# EAGLE design SL869-GL868-Cx (EAGLE 7.1.0)
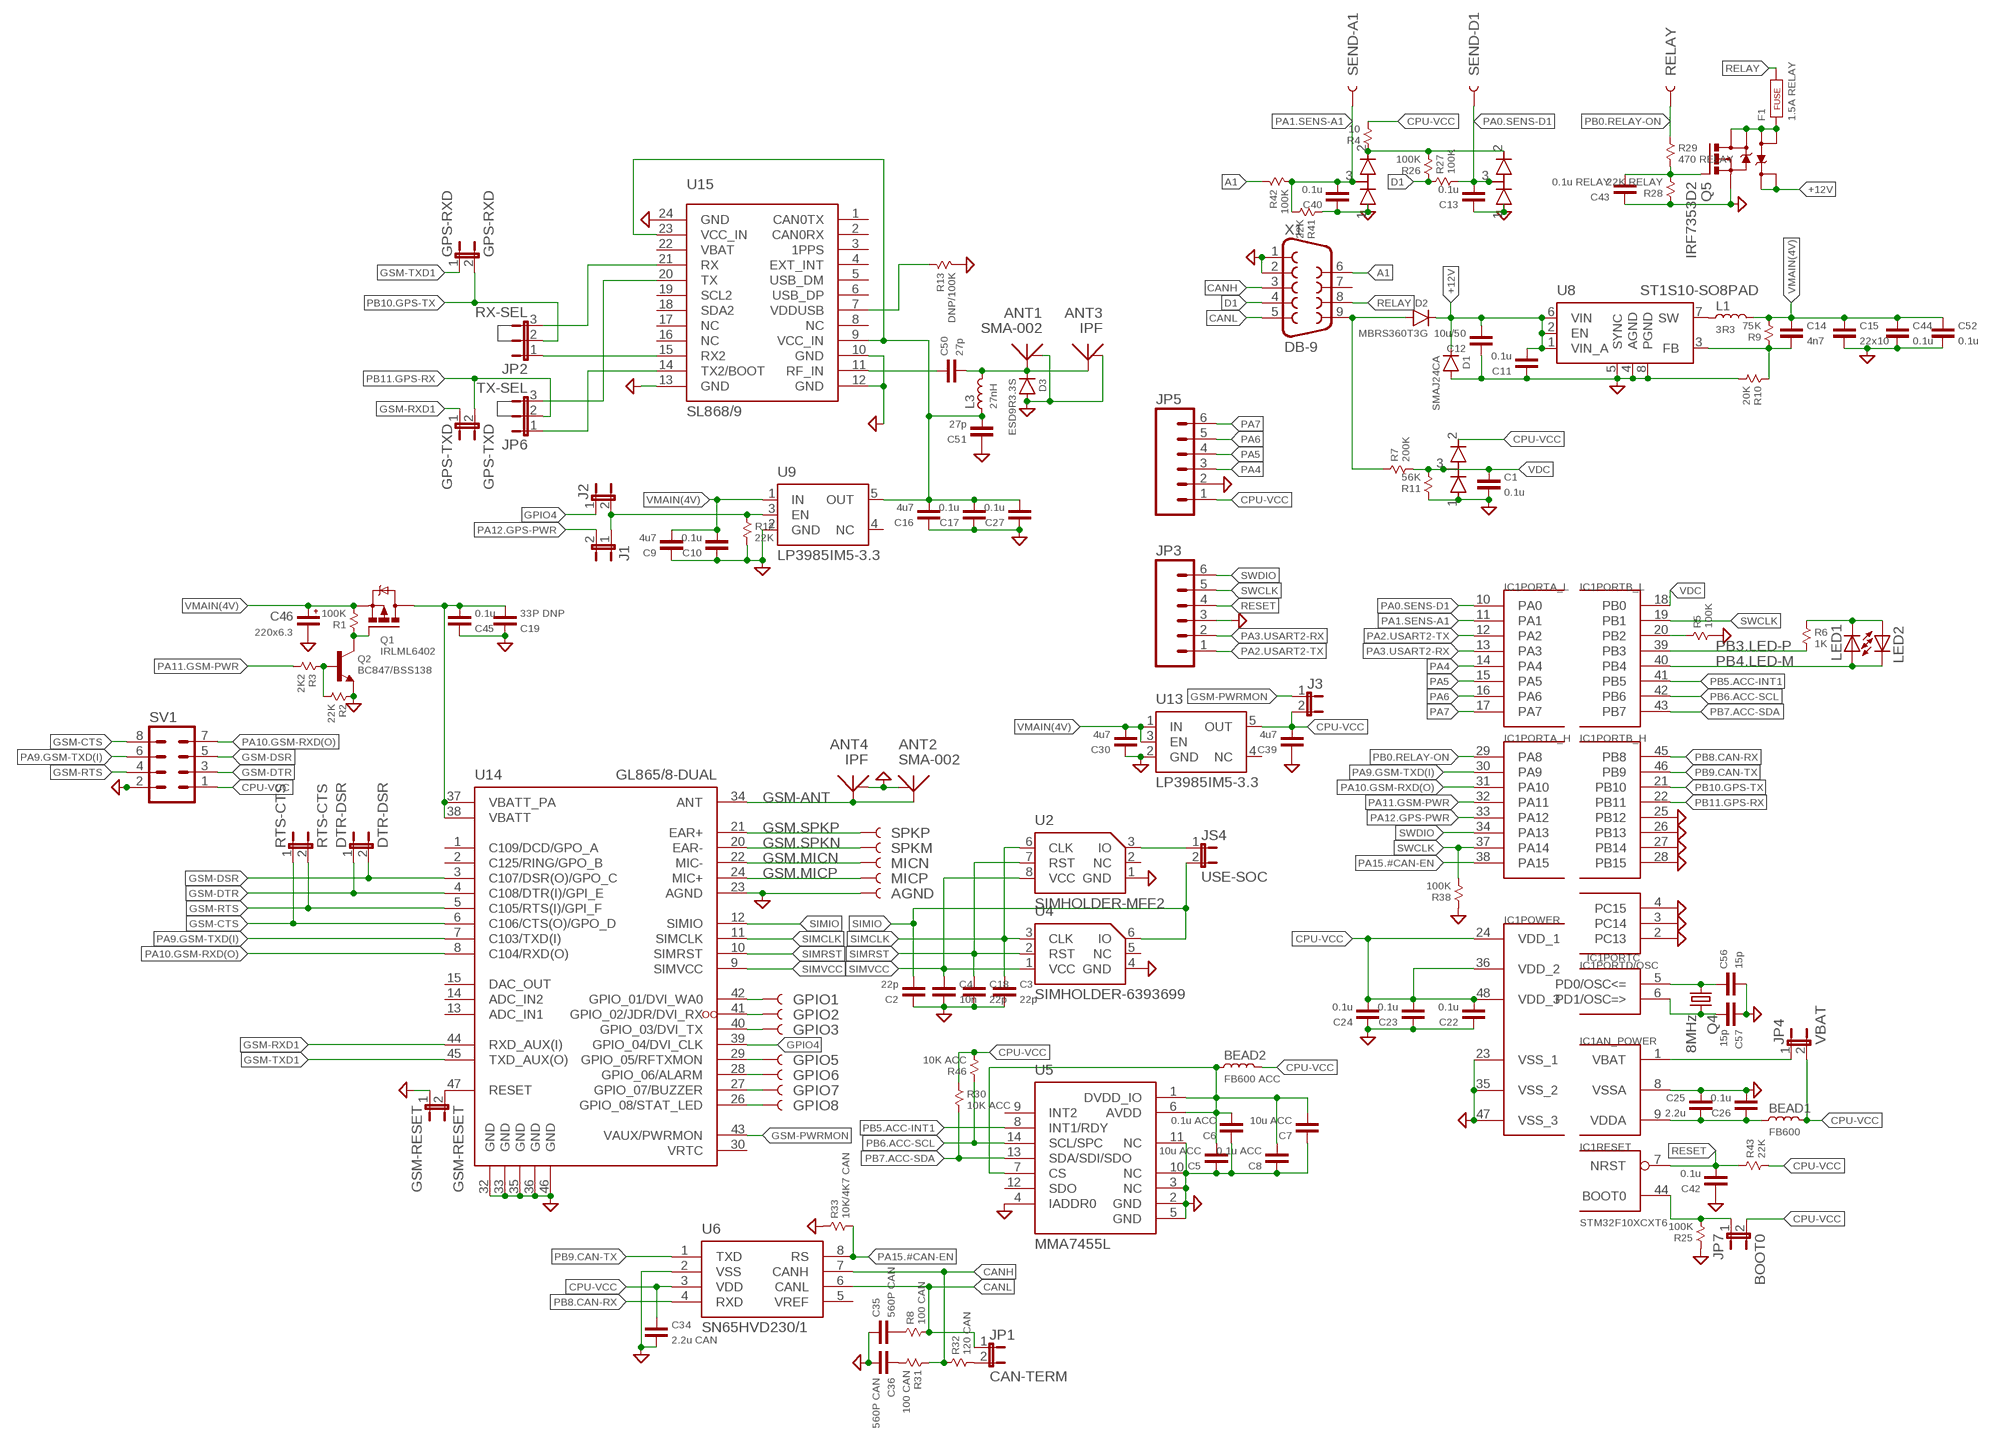
[diagram p0: schematic, sheet 1]

## Parts
AGND  TEST-POINT1  [PAD.1X1]
ANT1  SMA-002  ANTENNA-SMA-002  [SMA-002]
ANT2  SMA-002  ANTENNA-SMA-002  [SMA-002]
ANT3  IPF  ANTENNA-IPF  [MM9329]
ANT4  IPF  ANTENNA-IPF  [MM9329]
BEAD1  FB600  INDUCTOR-0603  [0603]
BEAD2  FB600 ACC  INDUCTOR-0603  [0603]
C1  0.1u  CAP-0603  [0603]
C2  22p  CAP-0603  [0603]
C3  22p  CAP-0603  [0603]
C4  10n  CAP-0603  [0603]
C5  10u ACC  CAP-0603  [0603]
C6  0.1u ACC  CAP-0603  [0603]
C7  10u ACC  CAP-0603  [0603]
C8  0.1u ACC  CAP-0603  [0603]
C9  4u7  CAP-0603  [0603]
C10  0.1u  CAP-0603  [0603]
C11  0.1u  CAP-0603  [0603]
C12  10u/50  CAP-1206  [1206]
C13  0.1u  CAP-0603  [0603]
C14  4n7  CAP-0603  [0603]
C15  22x10  CAP-1206  [1206]
C16  4u7  CAP-0603  [0603]
C17  0.1u  CAP-0603  [0603]
C18  22p  CAP-0603  [0603]
C19  33P DNP  CAP-0603  [0603]
C22  0.1u  CAP-0603  [0603]
C23  0.1u  CAP-0603  [0603]
C24  0.1u  CAP-0603  [0603]
C25  2.2u  CAP-0603  [0603]
C26  0.1u  CAP-0603  [0603]
C27  0.1u  CAP-0603  [0603]
C30  4u7  CAP-0603  [0603]
C34  2.2u CAN  CAP-0603  [0603]
C35  560P CAN  CAP-0603  [0603]
C36  560P CAN  CAP-0603  [0603]
C39  4u7  CAP-0603  [0603]
C40  0.1u  CAP-0603  [0603]
C42  0.1u  CAP-0603  [0603]
C43  0.1u RELAY  CAP-0603  [0603]
C44  0.1u  CAP-0603  [0603]
C45  0.1u  CAP-0603  [0603]
C46  220x6.3  CAP-POL-7343  [CT7343]
C50  27p  CAP-0603  [0603]
C51  27p  CAP-0603  [0603]
C52  0.1u  CAP-0603  [0603]
C56  15p  CAP-0603  [0603]
C57  15p  CAP-0603  [0603]
D1  SMAJ24CA  DIODE-SMA  [SMA]
D2  MBRS360T3G  DIODE-SMC  [SMC]
D3  ESD9R3.3S  DIODE-ESD9  [SOD-923]
D4  BAV99  [SOT-23]
D5  BAV99  [SOT-23]
D14  BAV99  [SOT-23]
DTR-DSR  DTR-DSR  JUMPER-2SMD-NO  [SJ_2S-NO]
F1  1.5A RELAY  FUSE  [1812]
GPIO1  TEST-POINT1  [PAD.1X1]
GPIO2  TEST-POINT1  [PAD.1X1]
GPIO3  TEST-POINT1  [PAD.1X1]
GPIO5  TEST-POINT1  [PAD.1X1]
GPIO6  TEST-POINT1  [PAD.1X1]
GPIO7  TEST-POINT1  [PAD.1X1]
GPIO8  TEST-POINT1  [PAD.1X1]
GPS-RXD  GPS-RXD  JUMPER-2SMD-NO  [SJ_2S-NO]
GPS-TXD  GPS-TXD  JUMPER-2SMD-NO  [SJ_2S-NO]
GSM-RESET  GSM-RESET  JUMPER-2SMD-NO  [SJ_2S-NO]
IC1  STM32F10XCXT6  [TQFP48]
J1  JUMPER-2SMD-NO  [SJ_2S-NO]
J2  JUMPER-2SMD-NO  [SJ_2S-NO]
J3  JUMPER-2SMD-NO  [SJ_2S-NO]
JP1  CAN-TERM  JUMPER-2SMD-NO  [SJ_2S-NO]
JP2  RX-SEL  JUMPER-3SMD  [SJ_3]
JP3  M06SIP  [1X06]
JP4  VBAT  JUMPER-2SMD-NO  [SJ_2S-NO]
JP5  M06SIP  [1X06]
JP6  TX-SEL  JUMPER-3SMD  [SJ_3]
JP7  BOOT0  JUMPER-2SMD-NO  [SJ_2S-NO]
JS4  USE-SOC  JUMPER-2SMD-NO  [SJ_2S-NO]
L1  3R3  INDUCTOR-CDRH6D38NP  [CDRH6D38NP]
L3  27nH  INDUCTOR-0603  [0603]
LED1  LED3MM  [LED3MM]
LED2  LED3MM  [LED3MM]
MICN  TEST-POINT1  [PAD.1X1]
MICP  TEST-POINT1  [PAD.1X1]
Q1  IRLML6402  [SOT-23]
Q2  BC847/BSS138  NPNBC847  [SOT-23]
Q4  8MHz  CRYSTALHC49UV  [HC49U-V]
Q5  IRF7353D2  [SO08]
R1  100K  RESISTOR-0603  [0603]
R2  22K  RESISTOR-0603  [0603]
R3  2K2  RESISTOR-0603  [0603]
R4  10  RESISTOR-0603  [0603]
R5  100K  RESISTOR-0603  [0603]
R6  1K  RESISTOR-0603  [0603]
R7  200K  RESISTOR-0603  [0603]
R8  100 CAN  RESISTOR-0603  [0603]
R9  75K  RESISTOR-0603  [0603]
R10  20K  RESISTOR-0603  [0603]
R11  56K  RESISTOR-0603  [0603]
R12  22K  RESISTOR-0603  [0603]
R13  DNP/100K  RESISTOR-0603  [0603]
R25  100K  RESISTOR-0603  [0603]
R26  100K  RESISTOR-0603  [0603]
R27  100K  RESISTOR-0603  [0603]
R28  22K RELAY  RESISTOR-0603  [0603]
R29  470 RELAY  RESISTOR-0603  [0603]
R30  10K ACC  RESISTOR-0603  [0603]
R31  100 CAN  RESISTOR-0603  [0603]
R32  120 CAN  RESISTOR-0603  [0603]
R33  10K/4K7 CAN  RESISTOR-0603  [0603]
R38  100K  RESISTOR-0603  [0603]
R41  22K  RESISTOR-0603  [0603]
R42  100K  RESISTOR-0603  [0603]
R43  22K  RESISTOR-0603  [0603]
R46  10K ACC  RESISTOR-0603  [0603]
RELAY  TEST-POINT1  [PAD.1X1]
RTS-CTS  RTS-CTS  JUMPER-2SMD-NO  [SJ_2S-NO]
SEND-A1  TEST-POINT1  [PAD.1X1]
SEND-D1  TEST-POINT1  [PAD.1X1]
SPKM  TEST-POINT1  [PAD.1X1]
SPKP  TEST-POINT1  [PAD.1X1]
SV1  MA04-2  [MA04-2]
U2  SIMHOLDER-MFF2  [MFF2]
U4  SIMHOLDER-6393699  [6393699-1]
U5  MMA7455L  [LGA14]
U6  SN65HVD230/1  MCP2551  [SO08]
U8  ST1S10-SO8PAD  [SO08-EPAD]
U9  LP3985IM5-3.3  TPS73033  [SOT23-5]
U13  LP3985IM5-3.3  TPS73033  [SOT23-5]
U14  GL865/8-DUAL  [GL865/8-DUAL]
U15  SL868/9  [SL868/9]
X1  DB-9  DB9  [DB9]

## Nets
+12-IN: D2.P$2(A) R7.1 X1.9
+12V: C11.1 C12.1 D1.P$1(C) D2.P$1(C) Q5.7(K) Q5.8(K) U8.1(VIN_A) U8.2(EN) U8.6(VIN)
A1: R42.1 X1.6
ACC-VCC: BEAD2.1 C5.1 C6.1 C7.1 C8.1 U5.1(DVDD_IO) U5.6(AVDD) U5.7(CS)
CANH: R31.1 R32.1 U6.7(CANH) X1.3
CANL: JP1.1 R8.2 U6.6(CANL) X1.5
CPU-VBAT: IC1.1(AN_POWER:VBAT) JP4.1
CPU-VCC: BEAD1.2 BEAD2.2 C22.1 C23.1 C24.1 C34.2 C39.1 D5.2(+) IC1.24(POWER:VDD_1) IC1.36(POWER:VDD_2) IC1.48(POWER:VDD_3) J3.2 JP4.2 JP5.1 JP7.2 R4.2 R30.1 R43.2 R46.2 SV1.1 U6.3(VDD) U13.5(OUT)
D1: R26.1 R27.1 X1.4
GND: AGND.P$1 ANT1.GND@1(GND) ANT2.GND@1(GND) ANT3.2(GND) ANT4.2(GND) C1.1 C2.2 C3.1 C4.1 C5.2 C6.2 C7.2 C8.2 C9.2 C10.2 C11.2 C12.2 C13.2 C15.1 C16.2 C17.2 C18.1 C19.2 C22.2 C23.2 C24.2 C25.2 C26.1 C27.2 C30.2 C34.1 C35.2 C36.1 C39.2 C40.2 C42.2 C43.2 C44.1 C45.2 C46.- C51.2 C52.1 C56.1 C57.2 D1.P$2(A) D3.2(A) D4.1(-) D5.1(-) D14.1(-) GSM-RESET.1 IC1.2(PORTC:PC13) IC1.3(PORTC:PC14) IC1.4(PORTC:PC15) IC1.8(AN_POWER:VSSA) IC1.23(POWER:VSS_1) IC1.25(PORTB_H:PB12) IC1.26(PORTB_H:PB13) IC1.27(PORTB_H:PB14) IC1.28(PORTB_H:PB15) IC1.35(POWER:VSS_2) IC1.47(POWER:VSS_3) JP3.3 JP5.2 Q2.2(E) Q5.3(S) R2.1 R5.2 R10.2 R11.1 R12.2 R13.2 R25.1 R28.1 R33.1 R38.1 R41.1 SV1.2 U2.1(GND) U4.4(GND) U5.2(GND) U5.3(NC) U5.4(IADDR0) U5.5(GND) U5.10(NC) U5.11(NC) U6.2(VSS) U8.4(AGND) U8.5(SYNC) U8.8(PGND) U9.2(GND) U13.2(GND) U14.23(AGND) U14.32(GND) U14.33(GND) U14.35(GND) U14.36(GND) U14.46(GND) U15.10(GND) U15.12(GND) U15.13(GND) U15.24(GND) X1.1 X1.2
GPIO1: GPIO1.P$1 U14.42(GPIO_01/DVI_WA0)
GPIO2: GPIO2.P$1 U14.41(GPIO_02/JDR/DVI_RX)
GPIO3: GPIO3.P$1 U14.40(GPIO_03/DVI_TX)
GPIO4: J2.1 U14.39(GPIO_04/DVI_CLK)
GPIO5: GPIO5.P$1 U14.29(GPIO_05/RFTXMON)
GPIO6: GPIO6.P$1 U14.28(GPIO_06/ALARM)
GPIO7: GPIO7.P$1 U14.27(GPIO_07/BUZZER)
GPIO8: GPIO8.P$1 U14.26(GPIO_08/STAT_LED)
GPS-PWR: J1.1 J2.2 R12.1 U9.3(EN)
GPS-RX0: JP2.1 U15.15(RX2)
GPS-RX1: JP2.3 U15.21(RX)
GPS-TX0: JP6.1 U15.14(TX2/BOOT)
GPS-TX1: JP6.3 U15.20(TX)
GPS-VCC: C16.1 C17.1 C27.1 C51.1 L3.1 U9.5(OUT) U15.9(VCC_IN) U15.23(VCC_IN)
GSM-ANT: ANT2.A(ANT) ANT4.1(ANT) U14.34(ANT)
GSM-CTS: RTS-CTS.1 SV1.8 U14.6(C106/CTS(O)/GPO_D)
GSM-DSR: DTR-DSR.2 SV1.5 U14.3(C107/DSR(O)/GPO_C)
GSM-DTR: DTR-DSR.1 SV1.3 U14.4(C108/DTR(I)/GPI_E)
GSM-PWRMON: J3.1 U14.43(VAUX/PWRMON)
GSM-RESET: GSM-RESET.2 U14.47(RESET)
GSM-RTS: RTS-CTS.2 SV1.4 U14.5(C105/RTS(I)/GPI_F)
GSM-RXD1: GPS-TXD.1 U14.44(RXD_AUX(I))
GSM-TXD1: GPS-RXD.1 U14.45(TXD_AUX(O))
GSM-VCC: C19.1 C45.1 Q1.3(D) U14.37(VBATT_PA) U14.38(VBATT)
GSM.MICN: MICN.P$1 U14.22(MIC-)
GSM.MICP: MICP.P$1 U14.24(MIC+)
GSM.SPKN: SPKM.P$1 U14.20(EAR-)
GSM.SPKP: SPKP.P$1 U14.21(EAR+)
N$1: JP1.2 R32.2
N$4: IC1.20(PORTB_L:PB2) R5.1
N$6: F1.1 Q5.1(A) Q5.2(A) Q5.5(D) Q5.6(D)
N$7: Q1.1(G) Q2.3(C) R1.1
N$10: JS4.1 U2.3(IO)
N$11: C50.2 U15.11(RF_IN)
N$12: Q2.1(B) R2.2 R3.1
N$13: L1.P$1 U8.7(SW)
N$14: C35.1 R8.1
N$15: C36.2 R31.2
N$16: R13.1 U15.7(VDDUSB)
N$19: LED1.K(C) LED2.A R6.1
N$25: C56.2 IC1.5(PORTD/OSC:PD0/OSC<=) Q4.1
N$28: IC1.44(RESET:BOOT0) JP7.1 R25.2
N$29: C14.1 R9.1 R10.1 U8.3(FB)
N$30: C57.1 IC1.6(PORTD/OSC:PD1/OSC=>) Q4.2
N$35: ANT1.A(ANT) ANT3.1(ANT) C50.1 D3.1(C) L3.2
N$51: C43.1 Q5.4(G) R28.2 R29.2
PA0.SENS-D1: C13.1 D4.3(S) IC1.10(PORTA_L:PA0) R27.2 SEND-D1.P$1
PA1.SENS-A1: C40.1 D14.3(S) IC1.11(PORTA_L:PA1) R41.2 R42.2 SEND-A1.P$1
PA2.USART2-TX: IC1.12(PORTA_L:PA2) JP3.1
PA3.USART2-RX: IC1.13(PORTA_L:PA3) JP3.2
PA4: IC1.14(PORTA_L:PA4) JP5.3
PA5: IC1.15(PORTA_L:PA5) JP5.4
PA6: IC1.16(PORTA_L:PA6) JP5.5
PA7: IC1.17(PORTA_L:PA7) JP5.6
PA9.GSM-TXD(I): IC1.30(PORTA_H:PA9) SV1.6 U14.7(C103/TXD(I))
PA10.GSM-RXD(O): IC1.31(PORTA_H:PA10) SV1.7 U14.8(C104/RXD(O))
PA11.GSM-PWR: IC1.32(PORTA_H:PA11) R3.2
PA12.GPS-PWR: IC1.33(PORTA_H:PA12) J1.2
PA15.#CAN-EN: IC1.38(PORTA_H:PA15) R33.2 U6.8(RS)
PB0.RELAY-ON: IC1.29(PORTA_H:PA8) R29.1 RELAY.P$1
PB3.LED-P: IC1.39(PORTB_L:PB3) R6.2
PB4.LED-M: IC1.40(PORTB_L:PB4) LED1.A LED2.K(C)
PB5.ACC-INT1: IC1.41(PORTB_L:PB5) U5.8(INT1/RDY)
PB6.ACC-SCL: IC1.42(PORTB_L:PB6) R46.1 U5.14(SCL/SPC)
PB7.ACC-SDA: IC1.43(PORTB_L:PB7) R30.2 U5.13(SDA/SDI/SDO)
PB8.CAN-RX: IC1.45(PORTB_H:PB8) U6.4(RXD)
PB9.CAN-TX: IC1.46(PORTB_H:PB9) U6.1(TXD)
PB10.GPS-TX: GPS-RXD.2 IC1.21(PORTB_H:PB10) JP2.2
PB11.GPS-RX: GPS-TXD.2 IC1.22(PORTB_H:PB11) JP6.2
RELAY: F1.2 X1.8
RESET: C42.1 IC1.7(RESET:NRST) JP3.4 R43.1
SENS-VCC: D4.2(+) D14.2(+) R4.1 R26.2
SIMCLK: C3.2 U2.6(CLK) U4.3(CLK) U14.11(SIMCLK)
SIMIO: C2.1 JS4.2 U4.6(IO) U14.12(SIMIO)
SIMRST: C18.2 U2.7(RST) U4.2(RST) U14.10(SIMRST)
SIMVCC: C4.2 U2.8(VCC) U4.1(VCC) U14.9(SIMVCC)
SWCLK: IC1.19(PORTB_L:PB1) IC1.37(PORTA_H:PA14) JP3.5 R38.2
SWDIO: IC1.34(PORTA_H:PA13) JP3.6
VDC: C1.2 D5.3(S) IC1.18(PORTB_L:PB0) R7.2 R11.2
VDDA: BEAD1.1 C25.1 C26.2 IC1.9(AN_POWER:VDDA)
VMAIN(4V): C9.1 C10.1 C14.2 C15.2 C30.1 C44.2 C46.+ C52.2 L1.P$2 Q1.2(S) R1.2 R9.2 U9.1(IN) U13.1(IN) U13.3(EN)
Unconnected: U2.2(NC) U4.5(NC) U5.9(INT2) U5.12(SDO) U6.5(VREF) U9.4(NC) U13.4(NC) U14.1(C109/DCD/GPO_A) U14.2(C125/RING/GPO_B) U14.13(ADC_IN1) U14.14(ADC_IN2) U14.15(DAC_OUT) U14.30(VRTC) U15.1(CAN0TX) U15.2(CAN0RX) U15.3(1PPS) U15.4(EXT_INT) U15.5(USB_DM) U15.6(USB_DP) U15.8(NC) U15.16(NC) U15.17(NC) U15.18(SDA2) U15.19(SCL2) U15.22(VBAT) X1.7

## Library data of the parts
AGND GPIO1-GPIO3 GPIO5-GPIO8 MICN MICP RELAY SEND-A1 SEND-D1 SPKM SPKP = SparkFun:TEST-POINT
ANT1-ANT4 = X893:ANTENNA: Antennes
BEAD1 BEAD2 L1 L3 = X893:INDUCTOR: http://www.murata.com/products/catalog/pdf/o05e.pdf
C1-C19 C22-C27 C30 C34-C36 C39 C40 C42-C45 C50-C52 C56 C57 = X893:CAP: Capacitor
C46 = X893:CAP-POL
D1-D3 = X893:DIODE
D4 D5 D14 = X893:BAV99: http://www.terraelectronica.ru/pdf/NXP/BAV99.pdf
DTR-DSR GPS-RXD GPS-TXD GSM-RESET J1-J3 JP1 JP4 JP7 JS4 RTS-CTS = SparkFun:JUMPER-2: Jumper Basic 0.1" spaced jumper. Use with breakaway headers.
F1 = X893:FUSE: http://smd.ru/files/upload/1236/ru/smd1812.pdf
IC1 = stm32:STM32F10XCXT6: ST STM32F101/103 48pin LQFP
JP2 JP6 = SparkFun:JUMPER-3
JP3 JP5 = SparkFun:M06: Header 6 Standard 6-pin 0.1" header. Use with straight break away headers (SKU : PRT-00116), right angle break away headers (PRT-00553), swiss pins (PRT-00743), machine pins (PRT-00117), and female headers (PRT-00115). Molex polarized connector foot print use with SKU : PRT-08094 with associated crimp pins and housings. NOTES ON THE VARIANTS LOCK and LOCK_LONGPADS... This footprint was designed to help hold the alignment of a through-hole component (i.e. 6-pin header) while soldering it into place. You may notice that each hole has been shifted either up or down by 0.005 of an inch from it's more standard position (which is a perfectly straight line). This slight alteration caused the pins (the squares in the middle) to touch the edges of the holes. Because they are alternating, it causes a "brace" to hold the component in place. 0.005 has proven to be the perfect amount of "off-center" position when using our standard breakaway headers. Although looks a little odd when you look at the bare footprint, once you have a header in there, the alteration is very hard to notice. Also, if you push a header all the way into place, it is covered up entirely on the bottom side. This idea of altering the position of holes to aid alignment will be further integrated into the Sparkfun Library for other footprints. It can help hold any component with 3 or more connection pins.
LED1 LED2 = led:LED: LED OSRAM: - CHIPLED LG R971, LG N971, LY N971, LG Q971, LY Q971, LO R971, LY R971 LH N974, LH R974 LS Q976, LO Q976, LY Q976 LO Q996 - Hyper CHIPLED LW Q18S LB Q993, LB Q99A, LB R99A - SideLED LS A670, LO A670, LY A670, LG A670, LP A670 LB A673, LV A673, LT A673, LW A673 LH A674 LY A675 LS A676, LA A676, LO A676, LY A676, LW A676 LS A679, LY A679, LG A679 - Hyper Micro SIDELED® LS Y876, LA Y876, LO Y876, LY Y876 LT Y87S - SmartLED LW L88C, LW L88S LB L89C, LB L89S, LG L890 LS L89K, LO L89K, LY L89K LS L896, LA L896, LO L896, LY L896 - TOPLED LS T670, LO T670, LY T670, LG T670, LP T670 LSG T670, LSP T670, LSY T670, LOP T670, LYG T670 LG T671, LOG T671, LSG T671 LB T673, LV T673, LT T673, LW T673 LH T674 LS T676, LA T676, LO T676, LY T676, LB T676, LH T676, LSB T676, LW T676 LB T67C, LV T67C, LT T67C, LS T67K, LO T67K, LY T67K, LW E67C LS E67B, LA E67B, LO E67B, LY E67B, LB E67C, LV E67C, LT E67C LW T67C LS T679, LY T679, LG T679 LS T770, LO T770, LY T770, LG T770, LP T770 LB T773, LV T773, LT T773, LW T773 LH T774 LS E675, LA E675, LY E675, LS T675 LS T776, LA T776, LO T776, LY T776, LB T776 LHGB T686 LT T68C, LB T68C - Hyper Mini TOPLED® LB M676 - Mini TOPLED Santana® LG M470 LS M47K, LO M47K, LY M47K Source: http://www.osram.convergy.de LUXEON: - LUMILED® LXK2-PW12-R00, LXK2-PW12-S00, LXK2-PW14-U00, LXK2-PW14-V00 LXK2-PM12-R00, LXK2-PM12-S00, LXK2-PM14-U00 LXK2-PE12-Q00, LXK2-PE12-R00, LXK2-PE12-S00, LXK2-PE14-T00, LXK2-PE14-U00 LXK2-PB12-K00, LXK2-PB12-L00, LXK2-PB12-M00, LXK2-PB14-N00, LXK2-PB14-P00, LXK2-PB14-Q00 LXK2-PR12-L00, LXK2-PR12-M00, LXK2-PR14-Q00, LXK2-PR14-R00 LXK2-PD12-Q00, LXK2-PD12-R00, LXK2-PD12-S00 LXK2-PH12-R00, LXK2-PH12-S00 LXK2-PL12-P00, LXK2-PL12-Q00, LXK2-PL12-R00 Source: www.luxeon.com KINGBRIGHT: KA-3528ASYC Source: www.kingbright.com
Q1 = X893:IRLML640: http://www.terraelectronica.ru/pdf/IR/IRLML6401.pdf http://www.terraelectronica.ru/pdf/IR/IRLML6402.pdf
Q2 = X893:NPN
Q4 = SparkFun:CRYSTAL: Crystals Various standard crystals. Proven footprints. Spark Fun Electronics SKU : COM-00534
Q5 = X893:IRF7353D2: http://www.irf.com/product-info/datasheets/data/irf7353d2.pdf
R1-R13 R25-R33 R38 R41-R43 R46 = X893:RESISTOR
SV1 = con-lstb:MA04-2: PIN HEADER; OC_FARNELL: unknown; OC_NEWARK: unknown
U2 U4 = X893:SIMHOLDER: SIM Holder
U5 = X893:MMA7455L: http://www.terraelectronica.ru/pdf/FRS/MMA7455L.pdf
U6 = SparkFun:MCP2551
U8 = X893:ST1S10: 3 A, 900 kHz, monolithic synchronous step-down regulator http://www.terraelectronica.ru/pdf/ST/ST1S10.pdf
U9 U13 = X893:TPS73033: LOW-NOISE, HIGH PSRR, RF 200-mA LOW-DROPOUT LINEAR REGULATOR http://www.terraelectronica.ru/pdf/TI/TPS73033.pdf
U14 = X893:GL865/8-DUAL
U15 = X893:SL868/9
X1 = SparkFun:DB9: DB9 Connector Standard DB9 (D-Sub 9) serial connector. Can be used for CAN bus as well as RS485 and RS232. Footprint production proven. Spark Fun Electronics SKU : PRT-00429

## Board
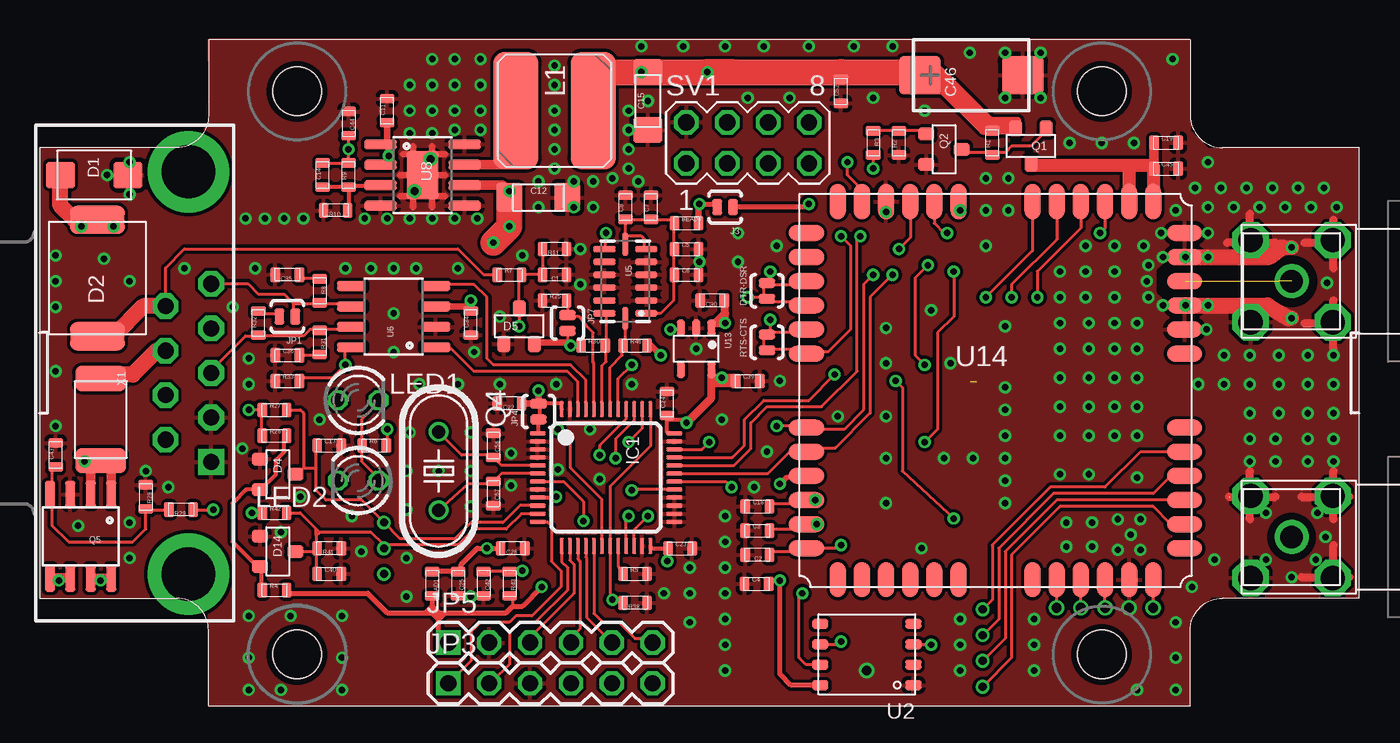
[diagram p1: board, top side]
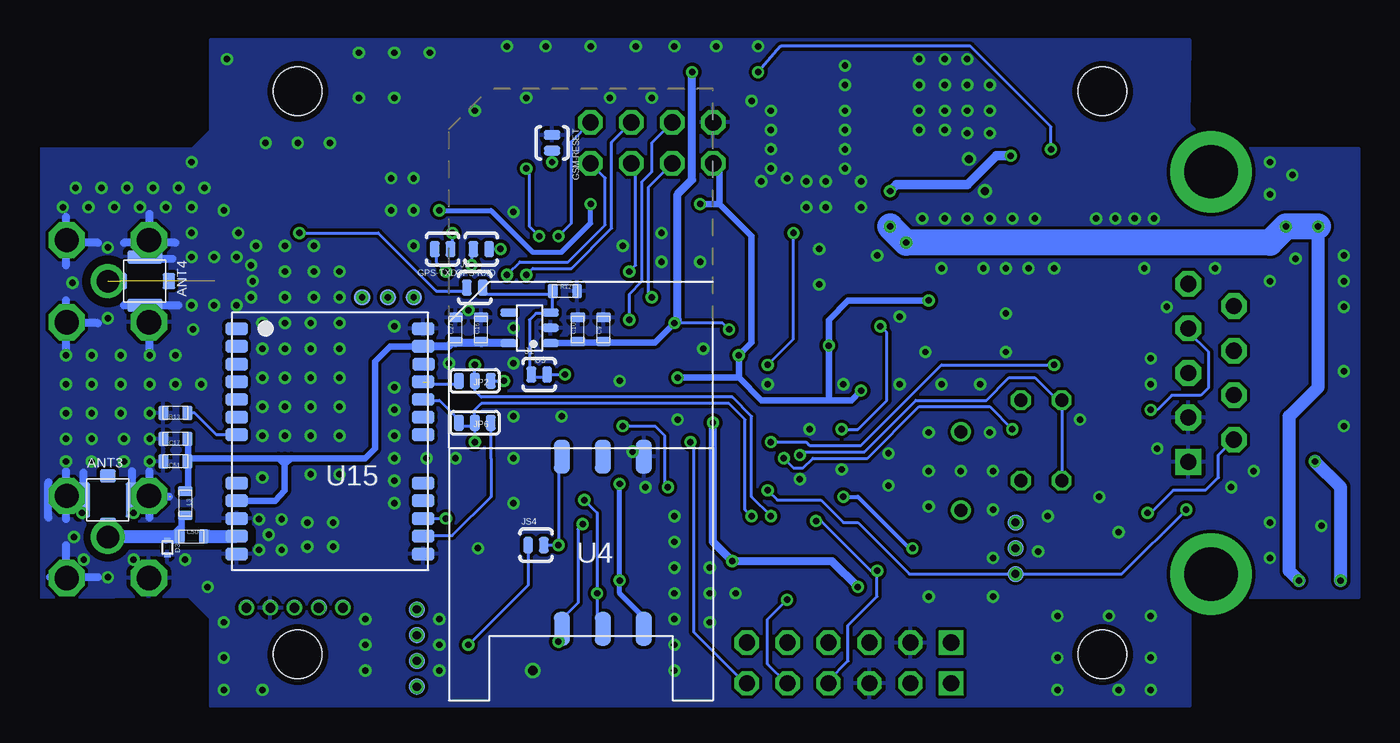
[diagram p2: board, bottom side, seen from below]

No outline drawn. Coordinates in mm, seen from the top.
Copper layers (1*16): Top 0.0356mm / dielectric 1.5011mm / Bottom 0.0356mm
Design rules "OSHPark *": minimum track width 6mil, minimum drill 13mil, track to track 6mil, track to pad 6mil, pad to pad 6mil, via to via 6mil, smd to smd 6mil, copper to edge 15mil, drill to drill 6mil, minimum pad ring 7mil, minimum via ring 7mil, stop-mask expansion 3mil, vias tented up to drill 0.4mm, thermal gap 10mil
tRestrict: area 76.5,25.1 to 79.1,27.7; area 76.6,9.3 to 79,11.7; 6 lines
bRestrict: area 76.5,25.1 to 79.1,27.7; area 76.6,9.3 to 79,11.7; 6 lines

### Footprints (pad centres in the part's own frame; a part is rotated, then mirrored left to right if it is on the bottom)
PAD.1X1 = smd 1 x 1: P$1 0,0
SMA-002 = drill 1.4 pad 2: A 0,0 | drill 1.5 pad 2 octagon: GND@1 -2.55,2.55; GND@2 2.55,2.55; GND@3 2.55,-2.55; GND@4 -2.55,-2.55
MM9329 = smd 1 x 0.8: 1 0,-1.5; P$3 0,1.5 | smd 0.8 x 2.2: 2 -1.5,0; 2@1 1.5,0
0603 = smd 0.6 x 0.9: 1 -0.75,0; 2 0.75,0
1206 = smd 1.6 x 1.8: 1 -1.8,0; 2 1.8,0
CT7343 = smd 2.6 x 2.4: + -3.2,0; - 3.2,0
SMA = smd 1.8 x 1.65: P$1 2.1,0; P$2 -2.1,0
SMC = smd 1.75 x 3.4: P$1 3.625,0; P$2 -3.625,0
SOD-923 = smd 0.3 x 0.4: 1 -0.45,0; 2 0.45,0
SOT-23 = smd 0.8 x 1: 1 -0.95,-1.1; 2 0.95,-1.1; 3 0,1.1
SJ_2S-NO = smd 0.6 x 1: 1 -0.49,0; 2 0.49,0
1812 = smd 1.58 x 3.15: 1 -2.55,0; 2 2.55,0
TQFP48 = smd 0.25 x 1: 1 -2.75,-4.25; 2 -2.25,-4.25; 3 -1.75,-4.25; 4 -1.25,-4.25; 5 -0.75,-4.25; 6 -0.25,-4.25; 7 0.25,-4.25; 8 0.75,-4.25; 9 1.25,-4.25; 10 1.75,-4.25; 11 2.25,-4.25; 12 2.75,-4.25; 25 2.75,4.25; 26 2.25,4.25; 27 1.75,4.25; 28 1.25,4.25; 29 0.75,4.25; 30 0.25,4.25; 31 -0.25,4.25; 32 -0.75,4.25; 33 -1.25,4.25; 34 -1.75,4.25; 35 -2.25,4.25; 36 -2.75,4.25 | smd 1 x 0.25: 13 4.25,-2.75; 14 4.25,-2.25; 15 4.25,-1.75; 16 4.25,-1.25; 17 4.25,-0.75; 18 4.25,-0.25; 19 4.25,0.25; 20 4.25,0.75; 21 4.25,1.25; 22 4.25,1.75; 23 4.25,2.25; 24 4.25,2.75; 37 -4.25,2.75; 38 -4.25,2.25; 39 -4.25,1.75; 40 -4.25,1.25; 41 -4.25,0.75; 42 -4.25,0.25; 43 -4.25,-0.25; 44 -4.25,-0.75; 45 -4.25,-1.25; 46 -4.25,-1.75; 47 -4.25,-2.25; 48 -4.25,-2.75
SJ_3 = smd 0.635 x 1: 1 -0.99,0; 2 0,0; 3 0.99,0
1X06 = drill 1 pad 1.5 square: 1 0,0 | drill 1 pad 1.5 octagon: 2 2.54,0; 3 5.08,0; 4 7.62,0; 5 10.16,0; 6 12.7,0
CDRH6D38NP = smd 7.3 x 2.8: P$1 0,-2.4; P$2 0,2.4
LED3MM = drill 0.813 octagon: A -1.27,0; K 1.27,0
HC49U-V = drill 0.813: 1 -2.44,0; 2 2.44,0
SO08 = smd 0.65 x 1.7: 1 -1.905,-2.6; 2 -0.635,-2.6; 3 0.635,-2.6; 4 1.905,-2.6; 5 1.905,2.6; 6 0.635,2.6; 7 -0.635,2.6; 8 -1.905,2.6
MA04-2 = drill 1.016 octagon: 1 -3.81,-1.27; 2 -3.81,1.27; 3 -1.27,-1.27; 4 -1.27,1.27; 5 1.27,-1.27; 6 1.27,1.27; 7 3.81,-1.27; 8 3.81,1.27
MFF2 = smd 1 x 0.6: 1 -2.9,1.905; 2 -2.9,0.635; 3 -2.9,-0.635; 4 -2.9,-1.905; 5 2.9,-1.905; 6 2.9,-0.635; 7 2.9,0.635; 8 2.9,1.905
6393699-1 = smd 2.1 x 1: 1 0.75,-2.6; 2 0.75,-0.06; 3 0.75,2.48; 4 11.45,-2.6; 5 11.45,-0.06; 6 11.45,2.48
LGA14 = smd 0.4 x 1.4: 1 2,1.3; 2 1.2,1.3; 3 0.4,1.3; 4 -0.4,1.3; 5 -1.2,1.3; 6 -2,1.3; 8 -2,-1.3; 9 -1.2,-1.3; 10 -0.4,-1.3; 11 0.4,-1.3; 12 1.2,-1.3; 13 2,-1.3 | smd 1.4 x 0.4: 7 -2.3,0; 14 2.3,0
SO08' = smd 0.6 x 1.8: 1 -1.905,-2.616; 2 -0.635,-2.616; 3 0.635,-2.616; 4 1.905,-2.616; 5 1.905,2.616; 6 0.635,2.616; 7 -0.635,2.616; 8 -1.905,2.616
SO08-EPAD = smd 0.6 x 2: 1 -1.905,-2.616; 2 -0.635,-2.616; 3 0.635,-2.616; 4 1.905,-2.616; 5 1.905,2.616; 6 0.635,2.616; 7 -0.635,2.616 | smd 0.61 x 2: 8 -1.905,2.616 | smd 3 x 2: EPAD 0,0
SOT23-5 = smd 0.5 x 1: 1 -0.95,-1.3; 2 0,-1.3; 3 0.95,-1.3; 4 0.95,1.3; 5 -0.95,1.3
GL865/8-DUAL = smd 2.2 x 1: 1 -11.75,9.8; 2 -11.75,8.3; 3 -11.75,6.8; 4 -11.75,5.3; 5 -11.75,3.8; 6 -11.75,2.3; 7 -11.75,-2.3; 8 -11.75,-3.8; 9 -11.75,-5.3; 10 -11.75,-6.8; 11 -11.75,-8.3; 12 -11.75,-9.8; 25 11.75,-9.8; 26 11.75,-8.3; 27 11.75,-6.8; 28 11.75,-5.3; 29 11.75,-3.8; 30 11.75,-2.3; 31 11.75,2.3; 32 11.75,3.8; 33 11.75,5.3; 34 11.75,6.8; 35 11.75,8.3; 36 11.75,9.8 | smd 1 x 2.2: 13 -9.8,-11.75; 14 -8.3,-11.75; 15 -6.8,-11.75; 16 -5.3,-11.75; 17 -3.8,-11.75; 18 -2.3,-11.75; 19 2.3,-11.75; 20 3.8,-11.75; 21 5.3,-11.75; 22 6.8,-11.75; 23 8.3,-11.75; 24 9.8,-11.75; 37 9.8,11.75; 38 8.3,11.75; 39 6.8,11.75; 40 5.3,11.75; 41 3.8,11.75; 42 2.3,11.75; 43 -2.3,11.75; 44 -3.8,11.75; 45 -5.3,11.75; 46 -6.8,11.75; 47 -8.3,11.75; 48 -9.8,11.75
SL868/9 = smd 1.4 x 0.8: 1 5.8,-7; 2 5.8,-5.9; 3 5.8,-4.8; 4 5.8,-3.7; 5 5.8,-2.6; 6 5.8,-1.5; 7 5.8,-0.4; 8 5.8,2.6; 9 5.8,3.7; 10 5.8,4.8; 11 5.8,5.9; 12 5.8,7; 13 -5.8,7; 14 -5.8,5.9; 15 -5.8,4.8; 16 -5.8,3.7; 17 -5.8,2.6; 18 -5.8,-0.4; 19 -5.8,-1.5; 20 -5.8,-2.6; 21 -5.8,-3.7; 22 -5.83,-4.8; 23 -5.8,-5.9; 24 -5.8,-7
G403 = hole 3: 66,38.2; 66,3.2; 16,38.2; 16,3.2
DB9 = drill 1 pad 1.6 square: 1 -5.54,-1.42 | drill 1 pad 1.6 octagon: 2 -2.77,-1.42; 3 0,-1.42; 4 2.77,-1.42; 5 5.54,-1.42; 6 -4.15,1.42; 7 -1.38,1.42; 8 1.38,1.42; 9 4.15,1.42 | drill 3.302 pad 5.08: G1 -12.5,0; G2 12.5,0

### Placement (x,y rotation side)
AGND  67.7,6.1 0 bottom
ANT1  77.8,10.5 90 top
ANT2  77.8,26.4 90 top
ANT3  77.8,12.8 0 bottom
ANT4  75.5,26.4 270 bottom
BEAD1  24.4,7.6 270 top
BEAD2  40.2,30 0 top
C1  32,26.8 180 top
C2  44.6,9.4 180 top
C3  44.6,10.9 0 top
C4  44.55,7.6 0 top
C5  40.2,28.4 0 top
C6  40.2,26.8 0 top
C7  38,31 90 top
C8  36.4,31 90 top
C9  47,23.4 90 bottom
C10  48.6,23.4 90 bottom
C11  21.6,37 90 top
C12  31,31.6 0 top
C13  18,16.2 0 top
C14  17.6,33 90 top
C15  37.8,37.6 90 top
C16  54.6,23.4 90 bottom
C17  73.6,16.6 180 bottom
C18  44.6,12.4 0 top
C19  70,35 0 top
C22  29.2,18.8 180 top
C23  39.8,9.8 0 top
C24  39,18.8 90 top
C25  26,7.6 270 top
C26  29.4,9.8 180 top
C27  56.2,23.4 90 bottom
C30  41.8,25.2 180 top
C34  26.8,23.8 90 top
C35  15.4,26.8 180 top
C36  15.4,21.8 0 top
C39  44,20.2 0 top
C40  18,8.2 0 top
C42  27.6,7.6 270 top
C43  1,15.6 90 top
C44  19.2,36.2 270 top
C45  70,33.4 0 top
C46  57.9,39.2 0 top
C50  72.6,10.55 0 bottom
C51  73.6,15.2 180 bottom
C52  49.8,38.2 90 top
C56  28.2,16.2 270 top
C57  28.2,13.2 270 top
D1  3.4,33 180 top
D2  3.6,26.6 90 top
D3  74.1,9.85 270 bottom
D4  14.8,14.4 270 top
D5  29.8,23.6 0 top
D14  14.8,9.6 270 top
DTR-DSR  45.2,25.8 90 top
F1  3.8,17.8 90 top
GPIO1  58.8,25.4 0 bottom
GPIO2  60.4,25.4 0 bottom
GPIO3  62,25.4 0 bottom
GPIO5  58.6,6 0 bottom
GPIO6  58.6,4.4 0 bottom
GPIO7  58.6,2.8 0 bottom
GPIO8  58.6,1.2 0 bottom
GPS-RXD  54.6,28.4 180 bottom
GPS-TXD  57,28.4 180 bottom
GSM-RESET  50.2,35 270 bottom
IC1  35.2,14.2 270 top
J1  51,20.6 0 bottom
J2  55,26 0 bottom
J3  42.6,31 180 top
JP1  15.4,24.2 180 top
JP2  55,20.2 180 bottom
JP3  25.4,1.4 0 top
JP4  31,18.3 90 top
JP5  25.4,3.94 0 top
JP6  55,17.6 180 bottom
JP7  32.8,23.8 270 top
JS4  51.2,10 0 bottom
L1  32,37 270 top
L3  73,12.6 270 bottom
LED1  19.8,19 0 top
LED2  19.8,14 180 top
MICN  66.2,6.1 0 bottom
MICP  69.2,6.1 0 bottom
Q1  61.6,34.8 180 top
Q2  56.2,34.6 270 top
Q4  24.8,14.6 270 top
Q5  2.55,10.55 180 top
R1  59.2,35 90 top
R2  53.4,35 90 top
R3  51.8,35 270 top
R4  14.6,7.2 0 top
R5  37,8.2 0 top
R6  20.8,16.2 0 top
R7  29.2,26.8 0 top
R8  17.4,25.8 270 top
R9  19.2,33 90 top
R10  18.4,30.8 180 top
R11  32,28.4 180 top
R12  49.4,25.8 0 bottom
R13  73.6,18.2 180 bottom
R25  32,25.2 0 top
R26  14.6,16.8 0 top
R27  14.6,18.4 0 top
R28  6.6,13 270 top
R29  8.8,12.2 180 top
R30  34.4,22.4 0 top
R31  17.4,22.6 270 top
R32  13.6,23.8 90 top
R33  15.4,20.2 0 top
R38  37,6.4 180 top
R41  18,9.8 180 top
R42  14.6,12 0 top
R43  29.2,7.6 270 top
R46  37,22.4 0 top
RELAY  21.4,8.2 0 bottom
RTS-CTS  45.2,22.6 90 top
SEND-A1  21.4,9.8 0 bottom
SEND-D1  21.4,11.4 0 bottom
SPKM  63.2,6.1 0 bottom
SPKP  64.7,6.1 0 bottom
SV1  44,35 0 top
U2  51.4,3.2 180 top
U4  47.1,4.05 90 bottom
U5  36.4,26.4 270 top
U6  SN65HVD230/1  [SO08']  22,24.2 90 top
U8  23.8,33 270 top
U9  51.6,23.5 90 bottom
U13  40.8,22.2 180 top
U14  59.4,19.6 0 top
U15  64,16.45 180 bottom
U$1  [G403]  0,0 0 top
X1  9.25,20.7 90 top

### Tracks (layer width: path | path; a pad name or v marks a point on that pad's centre or on a via)
+12-IN
  Top 0.2: X1.9 7.83,27.23 9,28.4 26,28.4 27.6,26.8 R7.1
  Top 0.8: 3.62,22.82 3.6,22.8 D2.P$2
  Top 1: X1.9 6.45,24.85 4.6,23 3.62,23 D2.P$2
+12V  (via drill 0.4)
  Top 0.2: C12.1 29.2,31.4
  Top 0.4: U8.2 21.7,33.63 v21.7,34.2 21.7,34.91 U8.1 21.09,34.91 21.6,35 C11.1
  Top 0.5: 3.75,7.95 Q5.7 | 3.85,7.95 v3.8,7.8 3.75,7.95 | Q5.8 3.85,7.95 | 3.85,7.95 3.75,7.95 | v2.6,29.8 D2.P$1
  Top 0.6: U8.6 28.77,32.37 v29.2,32
  Top 0.65: C12.1 v29.2,32
  Top 1: D1.P$1 1.3,31.1 2.17,30.23 D2.P$1 3.65,29.88 2.4,29.88
  Top 1.6: 29.2,31.4 v29.2,29.8 v28.2,28.8
  Bottom 0.6: v29.2,32 28.8,32.4 24.4,32.4 22.6,34.2 v21.7,34.2
  Bottom 0.8: v3.8,7.8 4.4,8.4 4.4,18 2.6,19.8 v2.6,29.8
  Bottom 1.6: v2.6,29.8 v4.6,29.8 5.6,28.8 v28.2,28.8 v29.2,29.8
A1  (via drill 0.4)
  Top 0.25: v13.2,12 R42.1
  Bottom 0.2: 13,12 11.6,13.4 9.6,13.4 8.8,14.2 8.8,15.6 8.2,16.2 8.18,16.2 X1.6
  Bottom 0.25: 13,12 v13.2,12
ACC-VCC
  Top 0.2: U5.6 37.6,28.4 37.6,29 37.4,29.2 36.4,29.2 | 36.4,29.2 C8.1 36.45,30.2 38,30.2 | 38,30.2 39.4,30.2 BEAD2.1 39.4,30 39.4,28.45 C5.1 39.4,28.4 39.4,26.85 C6.1 39.4,26.8 39.4,25.2 38.6,24.4 U5.1 | 38,30.2 C7.1 | U5.7 36.4,29.2
CANH
  Top 0.2: U6.7 19.36,23.57 19.2,23.4 17.45,23.4 R31.1 17.35,23.55 17.2,23.4 16.8,23.4 16.4,23 13.65,23 R32.1 13.55,23 12.8,23 11,21.2 11,21.03 X1.3
CANL
  Top 0.2: X1.5 12.96,26.24 13.6,25.6 15.2,25.6 15.8,25 | 15.8,25 17.35,25 R8.2 17.4,25 19.35,25 U6.6 | JP1.1 15.8,24.2 15.8,25
CPU-VBAT
  Top 0.25: IC1.1 31,16.95 JP4.1
CPU-VCC  (via drill 0.4)
  Top 0.2: JP7.2 32.8,22.4 v33,22.4 R30.1 | R43.2 29.35,6.85 29.4,6.8 29.4,6.2
  Top 0.25: 39,17.8 40.2,17.8 v40.2,17.6 | 30.61,18.8 JP4.2 32.45,18.79 IC1.48 | IC1.36 39,17 39,17.8 | 39,17.8 C24.1 | IC1.24 37.95,9.8 C23.1
  Top 0.3: R4.2 15.35,7.05 15.4,7 20.4,7 21.6,5.8 24,5.8 | 24,5.8 24.4,5.8 | 24.8,5.8 25.2,5.8 | 25.2,5.8 29,5.8 29.4,6.2 30,6.2 v31.2,7.4 | JP5.1 25.4,4 24.8,4.2 24.8,5.4 | 24.8,5.4 24.8,5.8 | BEAD1.2 24.4,6.2 | 24.4,6.2 24.4,5.8 | 24.4,5.8 24.8,5.8 | v41,31.2 42.11,31.2 J3.2 | 24.8,5.4 25.2,5.8 | 24.8,5.4 24.4,5.8 | 24.4,6.2 24.8,5.8 | 24.4,6.2 24,5.8
  Top 0.4: 30.61,18.8 C22.1 | R46.2 38,22.4 v38.6,21.8 | v41,31.2 40.95,31.05 BEAD2.2 | v39,9 39,9.75 C23.1 | U6.3 26.8,24.84 | C34.2 26.8,24.84 | 26.8,24.84 v26.8,25.2 | D5.2 30.75,22.65 30.8,22.6 32.8,22.6 v33,22.4 | 43.09,20.08 43.13,20.08 C39.1 | v31,19.6 JP4.2
  Top 0.5: U13.5 41.75,20.4 | 41.75,20.4 v42.4,20.4 43,20.4 43.05,20.35 C39.1 | v40.2,17.6 41.75,19.15 41.75,20.4 | 41.84,20.08 43.09,20.08
  Bottom 0.4: 39.8,31.2 37.8,29.2 37.8,22.6 v38.6,21.8 38.6,20.4 | v31,19.6 31.6,19 33,19 | 33,19 37.2,19 38.6,20.4 | 38.6,20.4 v42.4,20.4 | SV1.1 40.27,33.73 39.8,33.4 39.8,31.2 | 39.8,31.2 v41,31.2 | 33,19 v33,22.4 33,24 31.8,25.2 v26.8,25.2
  Bottom 0.5: v40.2,17.6 40.2,10.2 v39,9 32.8,9 v31.2,7.4
D1  (via drill 0.4)
  Top 0.2: R27.1 v13,18.4 | 13.8,17 13.8,18.35
  Top 0.25: R26.1 13.8,17 | 13.8,18.35 R27.1
  Bottom 0.2: X1.4 10.62,23.22 9.4,22 9.4,19.8 9.9,19.3 11.7,19.3 12.6,18.4 v13,18.4
GND  (via drill 0.4, 0.5, 0.6)  (1 unrouted)
  Top 0.4: 25.2,33 22.4,33 | 24.4,34.8 24.4,31 | 23.2,34.8 23.2,31 | 25.2,34.3 22.6,34.3 | 25.2,31.7 22.4,31.7
  Top 0.5: 75.2,28.8 73.8,28.8 | 75.2,28.8 76.8,28.8 | 78.6,28.8 81.2,28.8 | 78.6,23.8 81.2,23.8 | 80.4,27.2 80.4,30.2 | 75.2,28.8 75.2,30.6 | 80.4,22.2 80.4,25.2 | 78.4,13 81.4,13 | 75.2,11.6 75.2,14.6 | 73.9,13 76.8,13 | 80.4,11.6 80.4,14.6 | 80.4,7.2 80.4,10 | 78.4,8 81.4,8
  Top 0.9: 77.2,28.5 v77.8,28.5 | 77.6,24.1 v77.8,24.1
  Top 1: 71.1,27.9 76.4,27.9 77.2,28.5 | 71.6,24.9 76.3,24.9 77.6,24.1
  Bottom 0.2: 76.8,24.9 76.6,25 | 75.2,27.8 ANT4.2
  Bottom 0.5: 75.2,27.8 75.2,30.6 | 73.6,28.8 76.8,28.8 | 80.4,27.4 80.4,30.4 | 78.4,28.8 81.2,28.8 | v80.4,21.8 80.4,25.2 | 78.4,23.8 81.2,23.8 | 80.4,11.6 80.4,14.6 | 80.4,7.4 80.4,10 | 78.4,8 81.4,8 | 74,13 76.2,13 | 75.2,11.7 75.2,14.6 | ANT3.2 81.5,12.8 | 75.2,22 75.2,24.9 | 73.4,24.9 76.8,24.9 | 75.2,27.8 73.8,27.8 | 75.2,27.8 76.2,27.8 | 76.3,11.9 76.3,14.6 | 79.3,11.9 ANT3.2 | ANT3.2 79.3,14.5 | 81.5,11.7 81.5,12.8 | 81.5,12.8 81.5,13.9
  other vias: 4.2,33 5.6,33.8 5.6,31.8 23.3,32 24.3,34 5.6,26.4 9,27.2 1,28 1,24.8 1,20.8 1,17.4 2.4,11.2 13,5.6 5.6,9.2 25.8,35.8 25.8,30.3 70.4,40.2 5.6,11.4 23,35.6 65.4,11.4 68.4,11.6 68.2,14.2 68.2,16.8 66.8,18.6 63.4,16.8 72.6,29.4 72.5,23.4 80,26.3 76.2,12 79.9,10.5 77.8,8 70.6,1 72.6,27.9 72.6,24.9 69.7,29.4 74.2,31 62.2,40.6 72.6,33.8 68.2,20.4 73.6,21.8 75.2,21.8 77,21.8 78.8,21.8 75.2,15.2 76.8,15.2 78.8,15.2 80.4,15.2 75.2,16.6 75.2,18.2 79.4,12 79.3,9.1 76.2,9.1 73,9.1 67,11.6 80.6,31 79,31 77.4,31 75.8,31 67.7,6.1 68.2,1 70.6,5.2 70.6,3 15,10.8 13,3 15.6,5.6 13,1 68.8,26.4 63.4,14.4 71.6,7.4 51.4,2.2 65,25.4 63.4,27 63.4,20.4 63.4,23.8 63.4,25.4 60,14 63.4,22.2 63.4,18.6 66.8,16.8 66.8,20.4 68.2,18.6 6.6,14.6 65.2,23.8 65.2,22.2 65.2,20.4 65.2,18.6 65.2,16.8 65.2,14.4 65.4,9.9 67,9.7 68.4,9.7 63.8,9.9 63.8,11.4 60,12.6 68.2,22.2 66.8,22.2 73.6,20 75.2,20 68.9,25.4 15,1 70.6,30.8 72.6,31 24.4,35.6 23,30.3 24.4,30.3 27.4,35.8 1,26.4 58.8,30.8 68.9,27.4 65,27 66.8,23.8 68.2,23.8 66.8,25.4 66.8,27 68.6,28.6 71.2,24.9 71.2,27.9 69.8,24.9 69.8,27.9 79.8,32.2 78.2,32.2 76.6,32.2 75,32.2 73.4,32.2 71.8,32.2 77,20 77,18.2 76.8,16.6 60,15.4 60,16.8 60,18.4 58,15.4 72,20 78.8,20 80.4,20 80.4,18.2 78.8,18.2 78.8,16.6 80.4,16.6 12.6,16 8,13.6 16.2,13 20,9.6 67.8,10.65 60,19.8 27.2,30.3 21.6,30.3 20.2,30.3 32,37 32,33.4 32,34.6 32,35.8 32,38.6 32,39.8 36.6,35.8 31,32.6 31,31 33.2,32.6 34.4,32.6 33.2,31 34.4,31 36.6,37 37.4,41 35.6,32.8 27.4,37 24.4,40.2 25.8,40.2 27.4,38.6 27.4,40.2 25.8,37 24.4,37 23,37 23,38.6 24.4,38.6 25.8,38.6 40.8,22.2 41,27.6 37.2,32.6 26.8,12.4 22.8,12.2 26.8,14.6 24.8,14.6 22.8,14.6 23,17 26.8,17 29.3,13.7 19.4,11.8 27,22 28.6,24.2 22,24.4 22,27.2 52.6,15.4 56.2,15.4 49.6,18 17.4,17.8 13,20 13,21.6 23.6,20 26,20 66.8,28.6 65,28.6 45.2,15.8 56.6,21.3 52.6,18 60,40.6 60,37.8 62.2,37.8 58.8,32.8 32.2,14.7 44.4,13.6 34.8,14.1 34.2,17.2 61.8,5.4 61.8,3.8 61.8,2.2 18.8,5.6 18.8,3 18.8,1 42.6,11.8 42.6,10.2 42.6,8.6 46,20.2 55.4,24.6 60,23.6 52.6,21.3 52.6,23.5 52.6,30.7 58.8,28.6 52.6,12.6 54.8,9.8 43.4,29.4 43.4,27.6 45.8,28.6 44,37.8 46.6,37.8 51.8,37.8 55,37 60.2,32.8 60.2,30.8 64,35 66,35 68,35 38.8,7 42.6,7 42.4,17.8 22.8,9.2 22.8,6.8 22,22 12,24.8 33.6,28.4 26,27.2 23.4,27.2 20.6,27.2 30,28 26.8,6.8 28.6,20 40.4,8.6 40.4,7 40.4,5.2 42.6,5.4 42.6,3.8 42.6,2.2 57.2,3.8 57.2,2.2 57.2,5.4 16.4,30.3 15.2,30.3 14,30.3 12.8,30.3 13.4,27.2 19,27.2 4,27.8 33.6,26.2 32.1,20 36.8,20 36.6,34.6 36.6,33.4 37.8,37.6 57.8,40.6 40,41 42.6,41 45,41 47.8,41 50.6,41 53,41 29.3,15.7
  pour Top (isolate 0.2, rank 6): 10.55,0 10.55,6.75 0.05,6.75 0.05,34.65 9.05,34.65 10.6,36.2 10.55,41.4 71.45,41.4 71.45,35.75 72.6,34.6 81.95,34.65 81.95,6.75 72.8,6.8 71.45,5.45 71.45,0
  pour Bottom (isolate 0.2, rank 6): 10.55,0 10.55,6.75 0.05,6.75 0.05,34.65 9.05,34.65 10.6,36.2 10.55,41.4 71.45,41.4 71.45,35.75 72.6,34.6 81.95,34.65 81.95,6.75 72.8,6.8 71.45,5.45 71.45,0
GPIO1  (via drill 0.4)
  Top 0.2: U14.42 61.7,28.3 GPIO1.P$1
  other vias: 58.8,25.4
GPIO2  (via drill 0.4)
  Top 0.2: U14.41 63.2,29 60.4,26.2 GPIO2.P$1
  other vias: 60.4,25.4
GPIO3  (via drill 0.4)
  Top 0.2: U14.40 64.7,29.7 62,27 GPIO3.P$1
  other vias: 62,25.4
GPIO4  (via drill 0.4)
  Top 0.2: U14.39 66.2,29.7 v65.9,29.4
  Bottom 0.2: v65.9,29.4 61,29.4 57.4,25.8 55.6,25.8 J2.1
GPIO5  (via drill 0.5)
  Top 0.2: U14.29 68.4,15.8 66.2,13.6 62.8,13.6 59.2,10 59.2,6.6 GPIO5.P$1
  other vias: 58.6,6
GPIO6  (via drill 0.5)
  Top 0.2: U14.28 70.3,14.3 69.2,13.2 63,13.2 59.6,9.8 59.6,5.4 GPIO6.P$1
  other vias: 58.6,4.4
GPIO7  (via drill 0.5)
  Top 0.2: U14.27 63.2,12.8 60,9.6 60,4.2 GPIO7.P$1
  other vias: 58.6,2.8
GPIO8  (via drill 0.5)
  Top 0.2: U14.26 70.3,11.3 69.2,12.4 63.4,12.4 60.4,9.4 60.4,3 GPIO8.P$1
  other vias: 58.6,1.2
GPS-PWR
  Bottom 0.2: J1.1 51.6,20.6 51.6,24 51.2,24.4 50.6,24.4 50.55,24.45 U9.3 50.2,24.45 50.2,25.6 | R12.1 50.2,25.8 50.2,25.6 | 54.6,25.6 J2.2 54.51,25.8 54.4,25.8 54.4,25.6 50.2,25.6
GPS-RX0  (via drill 0.4)
  Top 0.2: v53.2,20.2 53.6,19.8 53.6,14.6 v56.8,11.65
  Bottom 0.2: JP2.1 54,20.4 JP2.1 v53.2,20.2 | U15.15 v56.8,11.65
GPS-RX1  (1 unrouted)
  Bottom 0.2: 57.85,20.15 57.8,20 56.2,20 JP2.3
GPS-TX0
  Bottom 0.2: JP6.1 54.01,15.39 54,15.4 54,13 56.4,10.6 58.6,10.6 58.65,10.55 U15.14
GPS-TX1
  Bottom 0.2: U15.20 57.95,19.05 57.8,19 57.2,19 56,17.8 JP6.3
GPS-VCC
  Bottom 0.4: U15.9 67.4,12.75 66.8,13.4 66.8,15 | C17.1 72.8,16.6 72.8,15.4 | C51.1 72.8,15.2 | 72.8,15.2 72.8,13.4 L3.1 | 72.8,15.2 72.8,15.4 | 72.8,15.4 67.2,15.4 | 67.2,15.4 66.8,15.4 | 66.8,15.4 66.8,15 | 66.8,15.4 66.4,15.4 | 66.4,15.4 61.8,15.4 61.2,16 61.2,21.4 60.25,22.35 U15.23 58.15,22.4 | 66.8,15 66.4,15.4 | 66.8,15 67.2,15.4
  Bottom 0.5: U9.5 54.6,22.55 | 54.6,22.55 56.2,22.55 | 56.2,22.55 56.45,22.55 56.65,22.35 U15.23 | C16.1 54.6,22.55 | C27.1 56.2,22.55
GSM-ANT  (2 unrouted)
GSM-CTS  (via drill 0.4)
  Top 0.2: RTS-CTS.1 45.6,22.2 47.4,22.2 47.4,21.8 47.55,21.8 U14.6 47.75,22 49,22 50.4,23.4 50.4,28.6 v49.8,29.2
  Bottom 0.2: v49.8,29.2 49,30 49,35.08 SV1.8
GSM-DSR  (via drill 0.4)
  Top 0.2: U14.3 47,26.4 47,26.2 45.4,26.2 DTR-DSR.2 45.4,26.29 45.4,26.4 v45.4,27
  Bottom 0.2: v45.4,27 45,27.4 45,33 45.4,33.4 45.4,33.6 SV1.5
GSM-DTR  (via drill 0.4)
  Top 0.2: v44,25.4 45.31,25.4 DTR-DSR.1 45.4,25.15 47.4,25.15 U14.4
  Bottom 0.2: v44,25.4 44.2,25.6 44.2,32.26 SV1.3
GSM-PWRMON  (via drill 0.4)
  Top 0.3: U14.43 57.1,30.9 v57.2,30.8 | v47.8,31.2 47.8,31 J3.1
  Bottom 0.3: v57.2,30.8 54,30.8 51.4,28.2 49.6,28.2 47.8,30 v47.8,31.2
GSM-RESET  (via drill 0.4)
  Top 0.2: U14.47 51.1,32.1 50.2,33 v50.2,33.8
  Bottom 0.2: v50.2,33.8 GSM-RESET.2
GSM-RTS  (via drill 0.4)
  Top 0.2: U14.5 47.4,23.2 45.6,23.2 RTS-CTS.2 45.31,23.09 45.4,23.2 v45.4,24
  Bottom 0.2: v45.4,24 45.4,25.6 44.6,26.4 44.6,32.6 44,33.2 44,35 SV1.4
GSM-RXD1  (via drill 0.4)
  Top 0.2: U14.44 55.6,30 56.2,29.4 v56.4,29.4
  Bottom 0.2: v56.4,29.4 56.4,28.51 GPS-TXD.1
GSM-TXD1  (via drill 0.4)
  Top 0.2: U14.45 54.1,29.1 v53.4,28.4
  Bottom 0.2: v53.4,28.4 GPS-RXD.1
GSM-VCC
  Top 0.6: C45.1 69.2,33.4 | C19.1 69.25,33.85 69.2,33.6
  Top 0.8: U14.37 69.2,33.4 69.2,33.6 67.7,33.6 | U14.38 67.7,33.6 | Q1.3 61.6,33.6 67.7,33.6
GSM.MICN  (via drill 0.6)
  Top 0.2: MICN.P$1 U14.22
  other vias: 66.2,6.1
GSM.MICP  (via drill 0.6)
  Top 0.2: MICP.P$1 U14.24
  other vias: 69.2,6.1
GSM.SPKN  (via drill 0.6)
  Top 0.2: SPKM.P$1 U14.20
  other vias: 63.2,6.1
GSM.SPKP  (via drill 0.6)
  Top 0.2: SPKP.P$1 U14.21
  other vias: 64.7,6.1
N$1
  Top 0.2: R32.2 13.6,24.4 14.71,24.4 JP1.2
N$3
  Top 0.25: 31.1,18 31.1,18.6
N$4
  Top 0.2: IC1.20 35.95,8.65 36.2,8.4 36.2,8.25 R5.1
N$5
  Top 0.2: 45,22.2 45,23
N$6  (via drill 0.4)
  Top 0.6: Q5.6 1.2,7.95 | 1.2,7.95 Q5.5 | 4.42,15.05 4.58,15 v2.8,15.2 3.19,15.02 Q5.2 | 4.42,15.05 F1.1 | 1.2,7.95 v1.2,7.8 | Q5.1 4.46,15.02 4.42,15.05
  Bottom 0.8: v1.2,7.8 1.2,13.6 v2.8,15.2
N$7
  Top 0.2: Q1.1 62.55,35.75 61.6,34.8 60.4,34.8 60,34.4 59.2,34.4 | 59.2,34.4 57.6,34.4 57.4,34.6 Q2.3 | R1.1 59.2,34.4
N$8
  Top 0.2: 45,25.4 45,26.2
N$9
  Bottom 0.2: 50.6,20.4 51.4,20.4
N$10  (via drill 0.4)
  Top 0.2: v55.4,3.8 54.47,3.8 U2.3
  Bottom 0.2: JS4.1 51.69,7.51 v55.4,3.8
N$11
  Bottom 0.2: C50.2 71.55,10.55
  Bottom 0.8: 71.55,10.55 U15.11
N$12
  Top 0.2: R3.1 51.8,35.8 53.35,35.8 R2.2 53.4,35.8 55.05,35.8 Q2.1
N$13
  Top 0.6: U8.7 29.54,33.63 L1.P$1
N$14
  Top 0.2: C35.1 16.2,26.6 17.35,26.6 R8.1
N$15
  Top 0.2: C36.2 17.35,21.8 R31.2
N$16
  Bottom 0.2: U15.7 71.05,16.85 72.4,18.2 R13.1
N$17
  Bottom 0.2: 55.8,17.4 55.2,17.4
N$19
  Top 0.2: LED1.K 21.07,18.87 20,17.8 20,16.4 | 20,16.4 20,15.2 21.07,14.13 LED2.A | R6.1 20,16.4
N$25
  Top 0.2: IC1.5 28.7,14.95 C56.2 28.2,15.6 26.24,15.6 Q4.1
N$28
  Top 0.2: IC1.44 34.45,21.25 34.4,21.4 34.4,23.2 34,23.6 33.51,24.2 32.8,24.2 JP7.1 32.8,25.2 R25.2
N$29
  Top 0.2: 21.16,32.33 21.18,32.35 U8.3
  Top 0.25: R9.1 19.4,32.2 19.52,32.33 21.16,32.33 | R9.1 19.2,30.8 R10.1 | R9.1 C14.1
N$30
  Top 0.2: IC1.6 28.7,14.45 C57.1 28.2,13.8 26.64,13.8 Q4.2
N$35
  Bottom 0.2: ANT1.A ANT3.1 | D3.1 74.2,10.3 74.2,10.5
  Bottom 0.4: 73.2,10.3 C50.1 73.5,10.5 | 73.2,10.3 73.2,11.2 | 73.2,11.2 73.2,11.85 L3.2 | 73.2,10.3 73.4,10.4 | 73.8,10.4 73.8,10.6 73.2,11.2
  Bottom 0.6: 77.75,10.55 arc-90 ANT1.A | 73.4,10.4 73.8,10.4
  Bottom 0.8: 73.5,10.5 74.2,10.5 ANT1.A
N$51
  Top 0.2: C43.1 1,14.8 0.8,14.6 0.8,13.11 | 0.8,13.11 Q5.4 | 0.8,13.11 0.8,11.2 1.8,10.2 5.8,10.2 6.6,11 R28.2 6.67,12.2 R29.2
PA0.SENS-D1  (via drill 0.5)
  Top 0.2: R27.2 16.2,18.4 16.4,18.2 16.4,14.8 | IC1.10 29.85,12.45 28.8,11.4 26.8,11.4 25.8,10.4 22.4,10.4 SEND-D1.P$1 20,12.8 17.8,12.8 17.2,13.4 17.2,14.8 | 17.2,14.8 17.2,16.35 C13.1 | 16.4,14.8 16,14.4 D4.3 | 16.4,14.8 17.2,14.8
  other vias: 21.4,11.4
PA1.SENS-A1  (via drill 0.5)
  Top 0.2: D14.3 17.2,9.6 | 17.2,9.6 R41.2 17.2,9.65 17.2,10.6 | IC1.11 29.95,11.95 29,11 27,11 26,10 21.4,10 | 21.4,10 20.6,10.8 17.4,10.8 | 17.4,10.8 17.2,10.6 | 21.4,10 SEND-A1.P$1 | R42.2 16.2,12 17.2,11 | 17.2,11 17.4,10.8 | 17.2,9.6 17.2,8.25 C40.1 | 17.2,10.6 17.2,11
  other vias: 21.4,9.8
PA2.USART2-TX
  Top 0.2: IC1.12 31.55,11.45 31.8,11.2 31.8,9 32.4,8.4 32.4,7.4 30.6,5.6 29.6,5.6 29.2,5.2 27.4,5.2 26.8,4.6 26.8,2.8 JP3.1
PA3.USART2-RX
  Top 0.2: IC1.13 32.45,8.95 32.8,8.6 32.8,7.2 30.8,5.2 29.8,5.2 29.2,4.6 29.2,2.6 28.06,1.46 28,1.46 JP3.2
PA4
  Top 0.2: JP5.3 30.54,4.2 30.6,4.4 33.2,7 33.2,8.8 32.95,9.05 IC1.14
PA5
  Top 0.2: IC1.15 33.45,9.15 33.6,9 33.6,4.8 33,4.2 33,3.96 JP5.4
PA6
  Top 0.2: IC1.16 33.95,9.25 34,9.2 34,5.5 JP5.5
PA7
  Top 0.2: IC1.17 34.45,5.75 35,5.2 36,5.2 37,4.2 37.84,4.2 JP5.6
PA9.GSM-TXD(I)  (via drill 0.4)
  Top 0.2: IC1.30 42.65,13.95 v43,13.6 | 47.6,17.4 v45.8,17.4 | v51.8,26.8 51.2,26.2 51.2,18.4 50,17.2 47.95,17.2 U14.7
  Top 0.25: U14.7 47.65,17.35 47.6,17.4
  Bottom 0.2: v45.8,17.4 43.8,17.4 43.2,16.8 43.2,13.8 v43,13.6 | v51.8,26.8 51.4,27.2 49,27.2 46.5,29.7 46.5,35.04 SV1.6
PA10.GSM-RXD(O)  (via drill 0.4)
  Top 0.2: 46.65,15.85 47.2,15.8 U14.8 | 46.65,15.85 45.25,14.45 IC1.31 | 46.65,15.85 47.25,16.05 49.45,16.05 51.6,18.2 51.6,25.4 v53,26.8
  Bottom 0.2: v53,26.8 52.2,27.6 49.2,27.6 46.9,29.9 46.9,32.82 SV1.7
PA11.GSM-PWR  (via drill 0.4)
  Top 0.2: v51,29.2 50.8,29 50.8,20.8 48.6,18.6 45.2,18.6 44.2,17.6 44.2,16 43.15,14.95 IC1.32 | v51.8,33.4 R3.2
  Bottom 0.2: v51,29.2 51.6,29.8 51.6,33.2 v51.8,33.4
PA12.GPS-PWR  (via drill 0.4)
  Top 0.2: v49.4,20.6 47.8,19 45,19 43.8,17.8 43.8,16.2 43.05,15.45 IC1.33
  Bottom 0.2: J1.2 v49.4,20.6
PA15.#CAN-EN  (via drill 0.4)
  Top 0.2: IC1.38 37.45,17.25 v36.6,16.4 | U6.8 19,22.5 v19,21.2 18.2,20.4 16.2,20.4 R33.2
  Bottom 0.2: v36.6,16.4 34.4,16.4 34.2,16.2 31,16.2 26,21.2 v19,21.2
PB0.RELAY-ON  (via drill 0.4, 0.5)
  Top 0.2: R29.1 v10.8,12.2 | IC1.29 36.85,13.45 v36.8,13.4
  Bottom 0.2: v10.8,12.2 14.8,8.2 RELAY.P$1 28,8.2 31.2,11.4 32.1,11.4 33.5,12.8 36.2,12.8 v36.8,13.4
  other vias: 21.4,8.2
PB3.LED-P  (via drill 0.4)
  Top 0.2: IC1.39 36.95,17.75 35.8,16.6 v35.8,15.4 | v21.6,17.2 21.6,16.45 R6.2
  Bottom 0.2: v35.8,15.4 35.2,14.8 34.6,14.8 34,15.4 30.6,15.4 27.4,18.6 23,18.6 v21.6,17.2
PB4.LED-M  (via drill 0.4)
  Top 0.2: IC1.40 36.45,17.85 34.8,16.2 v34.8,15.6
  Bottom 0.2: LED2.K LED1.A 18.73,19.2 19,19.2 20.2,20.4 21.8,20.4 23.2,19 27.6,19 30.8,15.8 34.6,15.8 v34.8,15.6
PB5.ACC-INT1  (via drill 0.4)
  Top 0.2: IC1.41 35.95,20.35 v36.8,21.2 | v35.2,29.4 U5.8
  Bottom 0.2: v36.8,21.2 35.2,22.8 v35.2,29.4
PB6.ACC-SCL
  Top 0.2: U5.14 36.4,22.4 36.25,22.35 R46.1 36.2,22.35 36.2,21.8 35.45,21.05 IC1.42
PB7.ACC-SDA
  Top 0.2: IC1.43 34.95,21.15 35.2,21.4 35.2,22.35 R30.2 | 35.2,22.15 R30.2 | U5.13 35.2,24.4 35.2,22.45 R30.2
PB8.CAN-RX
  Top 0.2: IC1.45 33.95,20.25 33,21.2 28.2,21.2 27.8,21.6 27.8,25.4 27,26.2 24.71,26.2 U6.4
PB9.CAN-TX
  Top 0.2: IC1.46 33.45,20.15 32.8,20.8 27,20.8 25.4,22.4 24.71,22.4 U6.1
PB10.GPS-TX  (via drill 0.4)
  Top 0.2: IC1.21 36.45,11.65 v36.6,11.8 | v55.2,27.4 54.4,26.6 54.4,21.8 v55,21.2
  Bottom 0.2: v36.6,11.8 37.8,13 37.8,18 39,19.2 54.6,19.2 55,19.6 JP2.2 v55,21.2 | GPS-RXD.2 55.2,28.4 v55.2,27.4
PB11.GPS-RX  (via drill 0.4)
  Top 0.2: IC1.22 36.95,10.95 v37.8,11.8 | v56.8,27 56.8,24.2 55.8,23.2 55.8,17.2 v55,16.4
  Bottom 0.2: v37.8,11.8 38.2,12.2 38.2,17.8 39.2,18.8 54.6,18.8 55,18.4 JP6.2 v55,16.4 | GPS-TXD.2 57.4,28.4 57.4,27.6 v56.8,27
RELAY
  Top 1: X1.8 7.28,22.08 5.8,20.6 3.65,20.6 F1.2
RESET  (via drill 0.4)
  Top 0.2: IC1.7 32.55,13.95 33.8,12.7 v33.8,11.5 | C42.1 27.6,8.4 29.15,8.4 R43.1 29.2,8.4 v30,8.4
  Bottom 0.2: JP3.4 33.02,1.58 31.8,2.8 31.8,5 30,6.8 v30,8.4 30.4,8.4 33.5,11.5 v33.8,11.5
SENS-VCC
  Top 0.25: R26.2 15.2,16.95 15.2,15.8 14.7,15.3 14.7,14.4 13.75,13.45 D4.2 12.85,13.45 12,12.6 12,10.2 13.55,8.65 D14.2 | D14.2 13.75,8.6 13.8,8.6 | R4.1 13.8,7.2 13.8,8.55 D14.2
SIMCLK  (via drill 0.4)
  Top 0.2: C3.2 45.55,10.95 45.6,11 47.6,11 U14.11 v48.3,11.3 | U2.6 49.63,3.83 v49.8,4
  Bottom 0.2: v49.8,4 49.6,4.8 49.6,4.78 U4.3 49.4,5.6 48.6,6.4 48.6,11 v48.3,11.3
SIMIO  (via drill 0.4)
  Top 0.2: C2.1 45.55,9.55 45.6,9.6 47.6,9.6 U14.12 49.6,9.8 v49.8,10
  Bottom 0.2: U4.6 49.58,15.38 49.8,15.2 v49.8,10 JS4.2
SIMRST  (via drill 0.4)
  Top 0.2: U14.10 v48.2,12.8 48,12.6 45.4,12.6 45.15,12.55 C18.2 | U2.7 47.63,2.56 47.2,3 47.2,7 v47.4,7
  Bottom 0.2: v48.2,12.8 47.4,12 v47.4,7 47.4,5.6 47.04,5.24 U4.2
SIMVCC  (via drill 0.4)
  Top 0.3: U14.9 47.6,14.2 46.4,14.2 v46,13.8 | C4.2 45.6,7.8 v46,7.8 46,2 46.7,1.29 U2.8
  Bottom 0.3: v46,13.8 v46,7.8 46,7 44.6,5.6 44.6,5.4 44.7,5.2 U4.1
SWCLK  (via drill 0.4)
  Top 0.2: R38.2 36.2,6.6 v35.6,6.6 35.45,6.75 IC1.19 35.45,13.65 37.95,16.15 IC1.37
  Bottom 0.2: JP3.5 35.6,1.4 36.8,2.6 36.8,5.4 v35.6,6.6
SWDIO  (via drill 0.4)
  Top 0.2: IC1.34 41.15,15.95 v41.6,16.4
  Bottom 0.2: v41.6,16.4 41.4,16.2 41.4,4.6 38.2,1.4 38.2,1.5 JP3.6
VDC  (via drill 0.4)
  Top 0.2: R11.2 31.25,27.05 | C1.2 31.25,27.05 | 31.25,27.05 31.2,26.8 R7.2 29.8,26.85 D5.3 v29.8,23.6 | IC1.18 34.95,12.85 33,14.8 33,16.4 v32.2,17.2
  Bottom 0.2: v32.2,17.2 31.2,17.2 29.4,19 29.4,23.2 v29.8,23.6
VDDA  (via drill 0.4)
  Top 0.25: IC1.9 32.05,12.95 v32.1,13
  Top 0.3: C26.2 28.6,10 28.6,9.8 v27.8,9.8 27.2,9.8 26.2,8.8 26.2,8.4 26.15,8.35 C25.1 25.95,8.4 24.4,8.4 BEAD1.1
  Bottom 0.25: v32.1,13 31.2,13 28,9.8 v27.8,9.8
VMAIN(4V)  (via drill 0.4)
  Top 0.2: C14.2 R9.2 v19.2,34.6 C44.2 | U13.3 39.85,23.55 39.8,23.4 v39.2,23.4 | R1.2 59.2,35.9
  Top 0.4: 55.4,38.4 55.6,38.8 | 59,36.4 60.8,36.4 60.8,36
  Top 0.5: 42.6,24.4 v42.6,23.8 42,23.8 | 42.6,24.4 42.6,25.15 C30.1 | U13.1 41.75,23.8 42,23.8 | C52.2 49.8,39.4 | v41.5,39.4 42.8,39.2 | 55.6,38.8 56.6,38.8 | 42,23.8 42.6,24.4
  Top 0.6: 55.6,38.8 55.6,39.8 56.6,38.8 59,36.4
  Top 0.8: Q1.2 59.2,35.9 58.7,35.9 56.2,38.4 55.4,38.4 55.1,38.6
  Top 1: 55.1,38.6 C46.+
  Top 1.6: L1.P$2 34.2,39.4 v37.4,39.4 C15.2 v41.5,39.4 | 43,39.4 v41.5,39.4 | v41.5,39.4 49.8,39.4 54.5,39.4 C46.+
  Bottom 0.2: v19.2,34.6 19.2,36 24.2,41 36,41 v37.4,39.4 | v39.2,23.4 39.6,23.8 v42.6,23.8
  Bottom 0.4: U9.1 48.7,22.55 C10.1 48.6,22.6 47.05,22.6 C9.1 47,22.6 43.8,22.6 v42.6,23.8
  Bottom 0.5: v42.6,23.8 42.4,24 42.4,31.8 41.5,32.7 v41.5,39.4

### Text on the board
Reference: VCC | GND | PA4 | PA5 | PA6 | PA7 | PA2.USART2-TX | PA3.USART2-RX | GND | RESET | SWCLK | SWDIO